# Altium project H7-Core.PrjPcb
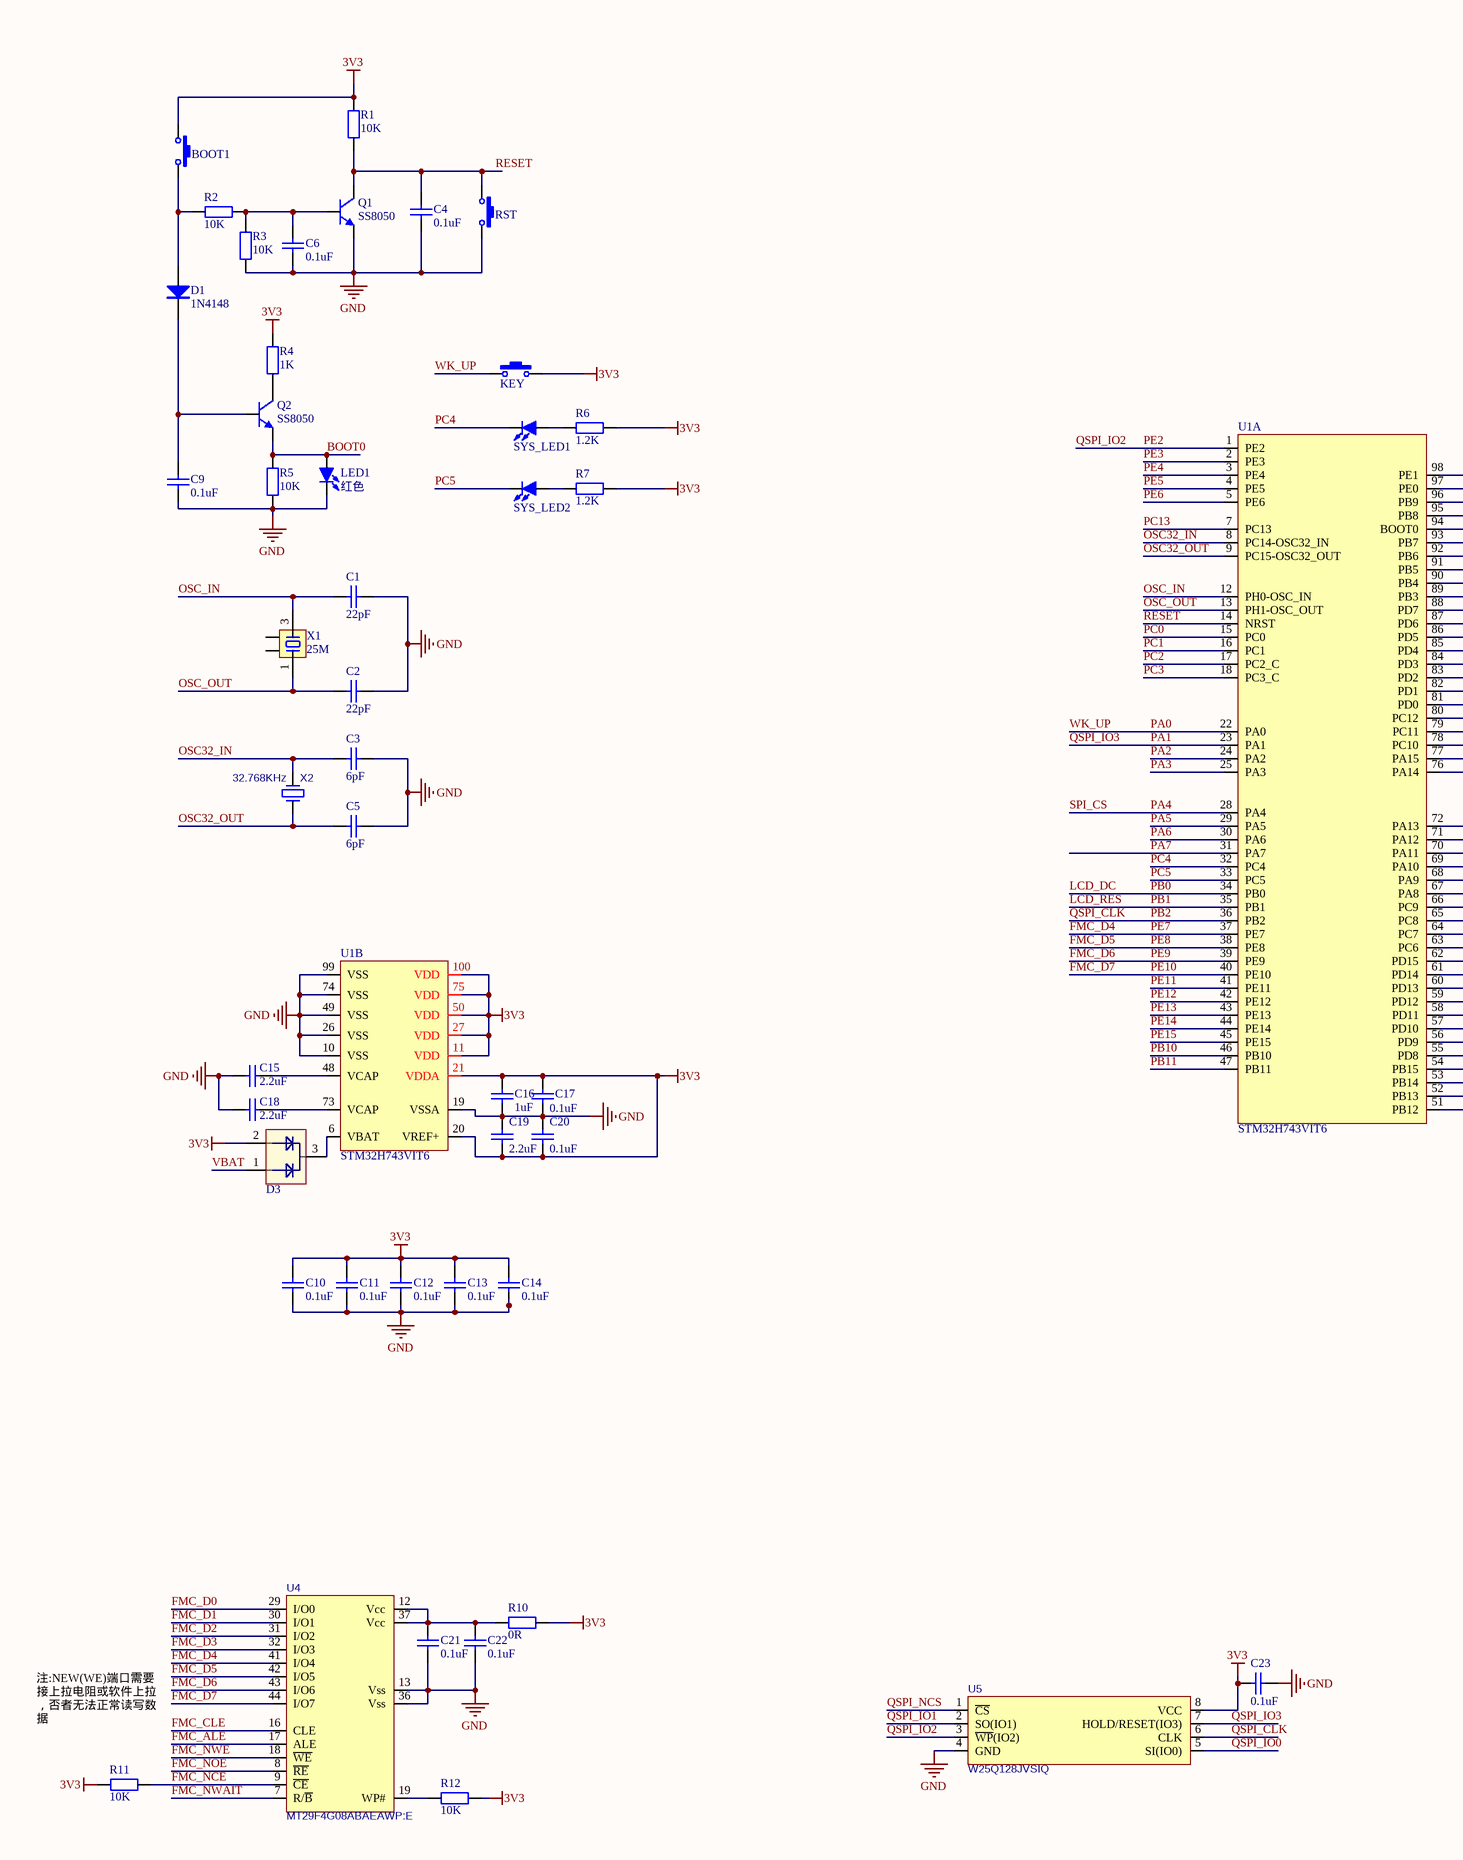
[diagram p0: H7-Core.SchDoc, left]
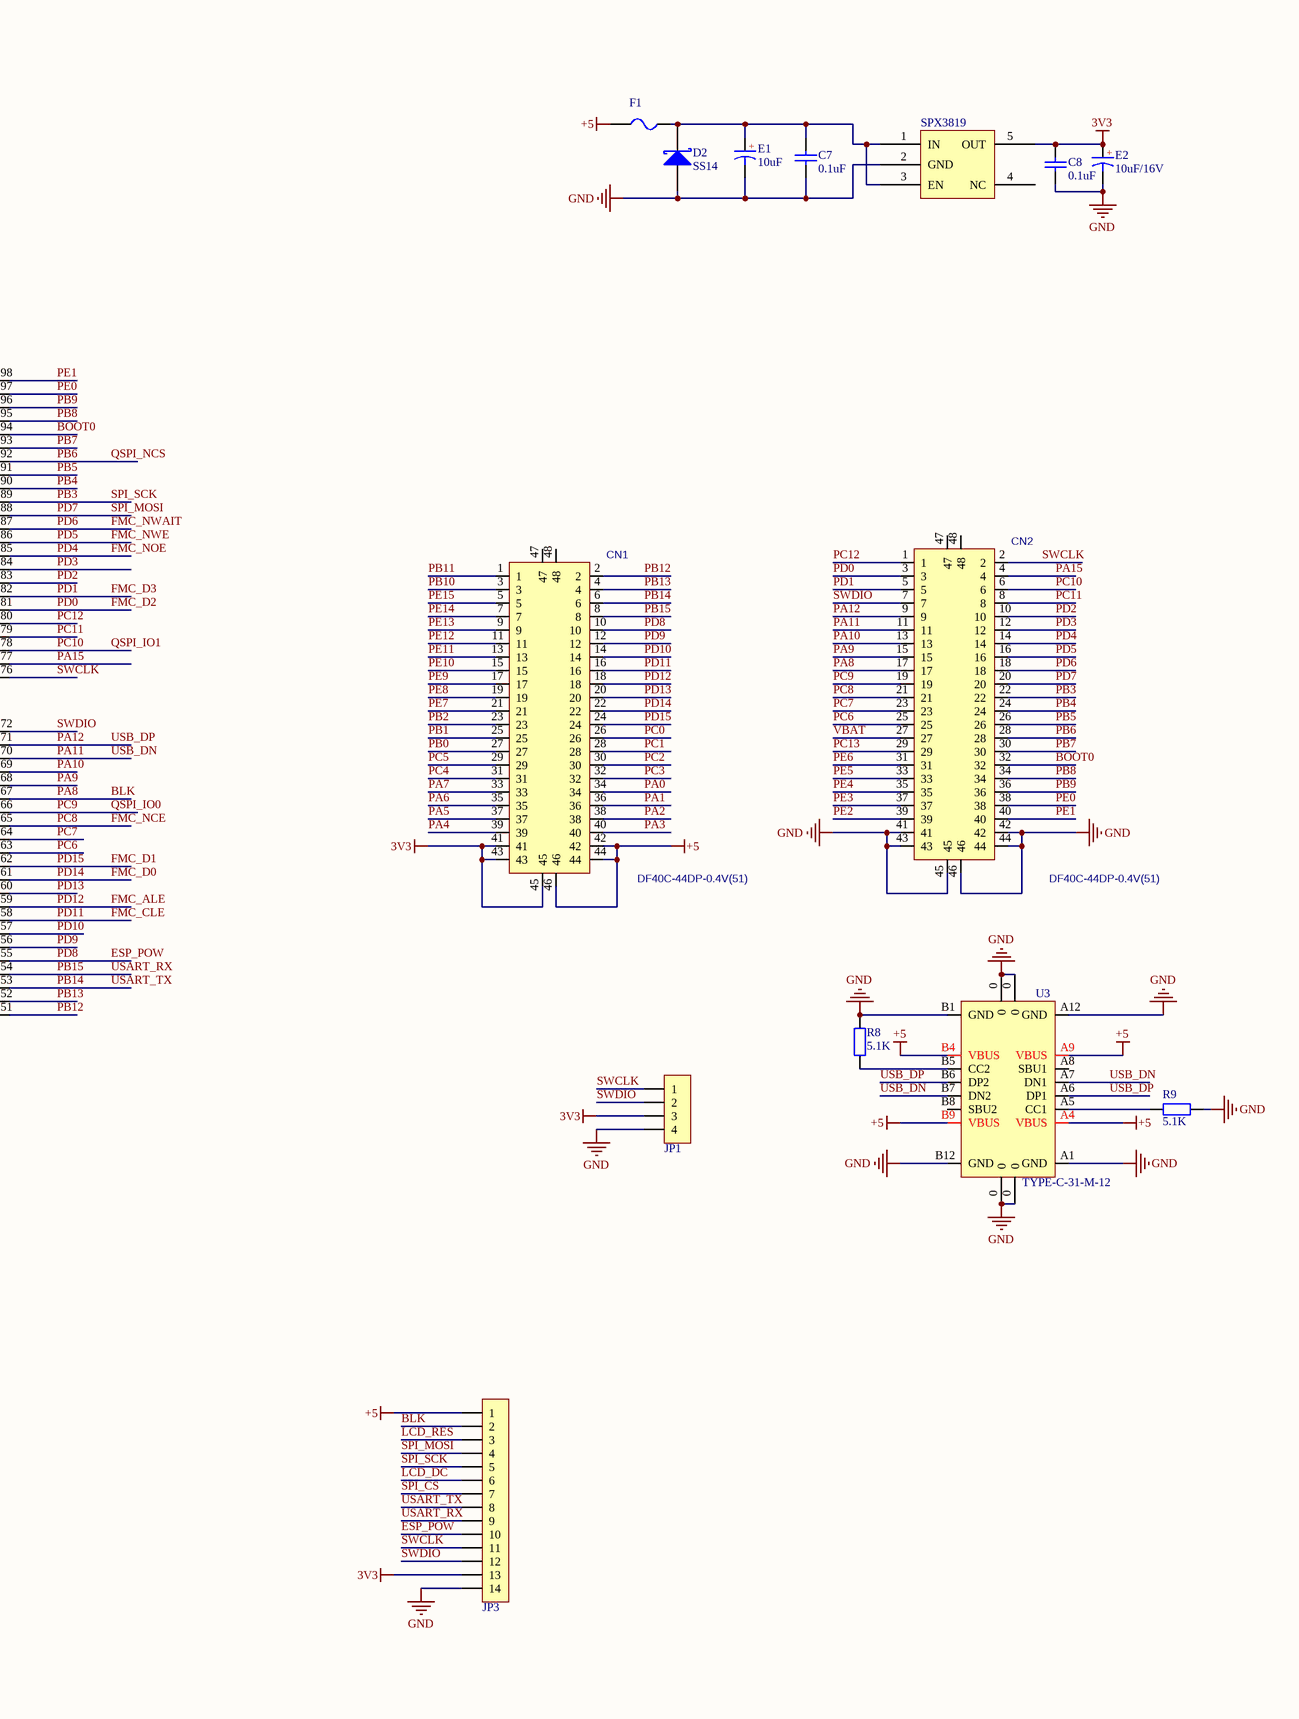
[diagram p1: H7-Core.SchDoc, right]
1 sheet, 60 parts. Net scope: global (net labels, ports and power ports of the same name join across sheets).
Board file: H7-Core.PcbDoc

## Sheet H7-Core.SchDoc
size A2; SheetNumber: 1; SheetTotal: 1

### Parts
BOOT1  3x6x5  [SW 3*6*4.3-S-W]  (value not drawn)
C1  22pF  [C0603_L]
C2  22pF  [C0603_L]
C3  6pF  [C0603_L]
C4  0.1uF  [C0603_L]
C5  6pF  [C0603_L]
C6  0.1uF  [C0603_L]
C7  0.1uF  [C0603_L]
C8  0.1uF  [C0603_L]
C9  0.1uF  [C0603_L]
C10  0.1uF  [C0603_L]
C11  0.1uF  [C0603_L]
C12  0.1uF  [C0603_L]
C13  0.1uF  [C0603_L]
C14  0.1uF  [C0603_L]
C15  2.2uF  [C0603_L]
C16  1uF  [C0603_L]
C17  0.1uF  [C0603_L]
C18  2.2uF  [C0603_L]
C19  2.2uF  [C0603_L]
C20  0.1uF  [C0603_L]
C21  0.1uF  [C0603_L]
C22  0.1uF  [C0603_L]
C23  0.1uF  [C0603_L]
CN1  DF40C-44DP-0.4V(51)  [DF40C-44DP-0.4V]
CN2  DF40C-44DP-0.4V(51)  [DF40C-44DP-0.4V]
D1  1N4148  [SOD-323]
D2  SS14  [SMA]
D3  BAT54C  [SOT23-3L]  (value not drawn)
E1  10uF  [C_3216]
E2  10uF/16V  [C_3216]
F1  MSMD200-8V 1A  [FU 0603]  (value not drawn)
JP1  HDR-1X4  [HDR2.54-LI-4P]  (value not drawn)
JP3  FH34SRJ-14S-0.5SH(50)  [FH34SRJ-14S-0.5SH(50)]  (value not drawn)
KEY  3x6x5  [SW 3*6*4.3-S-W]  (value not drawn)
LED1  红色  [LED0603_B]
Q1  SS8050  [SOT23-3N]
Q2  SS8050  [SOT23-3N]
R1  10K  [R0603_L]
R2  10K  [R0603_L]
R3  10K  [R0603_L]
R4  1K  [R0603_L]
R5  10K  [R0603_L]
R6  1.2K  [R0603_L]
R7  1.2K  [R0603_L]
R8  5.1K  [R0603_L]
R9  5.1K  [R0603_L]
R10  0R  [R0603_L]
R11  10K  [R0603_L]
R12  10K  [R0603_L]
RST  3x6x5  [SW 3*6*4.3-S-W]  (value not drawn)
SYS_LED1  红色  [LED0603_G]  (value not drawn)
SYS_LED2  绿色  [LED0603_G]  (value not drawn)
U1  STM32H743VIT6  [LQFP-100]  (parts A,B of 2)
U2  SPX3819  [SOT23-5L]
U3  TYPE-C-31-M-12  [TYPE-C-31-M-12]
U4  MT29F4G08ABAEAWP:E  [TSOP-48]
U5  W25Q128JVSIQ  [SOIC-8W]
X1  25M  [OSC 3225-4P]
X2  32.768KHz  [SMD3215-2P]

### Nets
3V3: BOOT1.1 C8.2 C10.2 C11.2 C12.2 C13.2 C14.2 C16.2 C17.2 C19.1 C20.1 C23.1 CN1.41 CN1.43 CN1.45 D3.2 E2.1(A) JP1.3 JP3.13 KEY.2 R1.1 R4.2 R6.2 R7.2 R10.2 R11.1 R12.2 U1.11(VDD) U1.20(VREF+) U1.21(VDDA) U1.27(VDD) U1.50(VDD) U1.75(VDD) U1.100(VDD) U2.5(OUT) U5.8(VCC)
+5: CN1.42 CN1.44 CN1.46 F1.1 JP3.1 U3.A4(VBUS) U3.A9(VBUS) U3.B4(VBUS) U3.B9(VBUS)
GND: C1.1 C2.1 C3.1 C4.2 C5.1 C6.2 C7.1 C8.1 C9.2 C10.1 C11.1 C12.1 C13.1 C14.1 C15.1 C16.1 C17.1 C18.1 C19.2 C20.2 C21.1 C22.1 C23.2 CN2.41 CN2.42 CN2.43 CN2.44 CN2.45 CN2.46 D2.1(A) E1.2(K) E2.2(K) JP1.4 JP3.14 LED1.2(K) Q1.2(E) R3.1 R5.2 R8.2 R9.1 RST.2 U1.10(VSS) U1.19(VSSA) U1.26(VSS) U1.49(VSS) U1.74(VSS) U1.99(VSS) U2.2(GND) U3.0 U3.A1(GND) U3.A12(GND) U3.B1(GND) U3.B12(GND) U4.13(Vss) U4.36(Vss) U5.4(GND)
BLK: CN2.17 JP3.2 U1.67(PA8)  [also labelled PA8]
BOOT0: CN2.32 LED1.1(A) Q2.2(E) R5.1 U1.94(BOOT0)
ESP_POW: CN1.10 JP3.10 U1.55(PD8)  [also labelled PD8]
FMC_ALE: CN1.18 U1.59(PD12) U4.17(ALE)  [also labelled PD12]
FMC_CLE: CN1.16 U1.58(PD11) U4.16(CLE)  [also labelled PD11]
FMC_D0: CN1.22 U1.61(PD14) U4.29(I/O0)  [also labelled PD14]
FMC_D1: CN1.24 U1.62(PD15) U4.30(I/O1)  [also labelled PD15]
FMC_D2: CN2.3 U1.81(PD0) U4.31(I/O2)  [also labelled PD0]
FMC_D3: CN2.5 U1.82(PD1) U4.32(I/O3)  [also labelled PD1]
FMC_D4: CN1.21 U1.37(PE7) U4.41(I/O4)  [also labelled PE7]
FMC_D5: CN1.19 U1.38(PE8) U4.42(I/O5)  [also labelled PE8]
FMC_D6: CN1.17 U1.39(PE9) U4.43(I/O6)  [also labelled PE9]
FMC_D7: CN1.15 U1.40(PE10) U4.44(I/O7)  [also labelled PE10]
FMC_NCE: CN2.21 R11.2 U1.65(PC8) U4.9(~{CE})  [also labelled PC8]
FMC_NOE: CN2.14 U1.85(PD4) U4.8(~{RE})  [also labelled PD4]
FMC_NWAIT: CN2.18 U1.87(PD6) U4.7(R/~{B})  [also labelled PD6]
FMC_NWE: CN2.16 U1.86(PD5) U4.18(~{WE})  [also labelled PD5]
LCD_DC: CN1.27 JP3.6 U1.34(PB0)  [also labelled PB0]
LCD_RES: CN1.25 JP3.3 U1.35(PB1)  [also labelled PB1]
OSC32_IN: C3.2 U1.8(PC14-OSC32_IN) X2.2
OSC32_OUT: C5.2 U1.9(PC15-OSC32_OUT) X2.1
OSC_IN: C1.2 U1.12(PH0-OSC_IN) X1.3
OSC_OUT: C2.2 U1.13(PH1-OSC_OUT) X1.1
PA0: CN1.34 KEY.1 U1.22(PA0)  [also labelled WK_UP]
PA1: CN1.36 U1.23(PA1) U5.7(HOLD/RESET(IO3))  [also labelled QSPI_IO3]
PA2: CN1.38 U1.24(PA2)
PA3: CN1.40 U1.25(PA3)
PA4: CN1.39 JP3.7 U1.28(PA4)  [also labelled SPI_CS]
PA5: CN1.37 U1.29(PA5)
PA6: CN1.35 U1.30(PA6)
PA7: CN1.33 U1.31(PA7)
PA9: CN2.15 U1.68(PA9)
PA10: CN2.13 U1.69(PA10)
PA11: CN2.11 U1.70(PA11) U3.A7(DN1) U3.B7(DN2)  [also labelled USB_DN]
PA12: CN2.9 U1.71(PA12) U3.A6(DP1) U3.B6(DP2)  [also labelled USB_DP]
PA15: CN2.4 U1.77(PA15)
PB2: CN1.23 U1.36(PB2) U5.6(CLK)  [also labelled QSPI_CLK]
PB3: CN2.22 JP3.5 U1.89(PB3)  [also labelled SPI_SCK]
PB4: CN2.24 U1.90(PB4)
PB5: CN2.26 U1.91(PB5)
PB6: CN2.28 U1.92(PB6) U5.1(~{CS})  [also labelled QSPI_NCS]
PB7: CN2.30 U1.93(PB7)
PB8: CN2.34 U1.95(PB8)
PB9: CN2.36 U1.96(PB9)
PB10: CN1.3 U1.46(PB10)
PB11: CN1.1 U1.47(PB11)
PB12: CN1.2 U1.51(PB12)
PB13: CN1.4 U1.52(PB13)
PB14: CN1.6 JP3.8 U1.53(PB14)  [also labelled USART_TX]
PB15: CN1.8 JP3.9 U1.54(PB15)  [also labelled USART_RX]
PC0: CN1.26 U1.15(PC0)
PC1: CN1.28 U1.16(PC1)
PC2: CN1.30 U1.17(PC2_C)
PC3: CN1.32 U1.18(PC3_C)
PC4: CN1.31 SYS_LED1.2(K) U1.32(PC4)
PC5: CN1.29 SYS_LED2.2(K) U1.33(PC5)
PC6: CN2.25 U1.63(PC6)
PC7: CN2.23 U1.64(PC7)
PC9: CN2.19 U1.66(PC9) U5.5(SI(IO0))  [also labelled QSPI_IO0]
PC10: CN2.6 U1.78(PC10) U5.2(SO(IO1))  [also labelled QSPI_IO1]
PC11: CN2.8 U1.79(PC11)
PC12: CN2.1 U1.80(PC12)
PC13: CN2.29 U1.7(PC13)
PD2: CN2.10 U1.83(PD2)
PD3: CN2.12 U1.84(PD3)
PD7: CN2.20 JP3.4 U1.88(PD7)  [also labelled SPI_MOSI]
PD9: CN1.12 U1.56(PD9)
PD10: CN1.14 U1.57(PD10)
PD13: CN1.20 U1.60(PD13)
PE0: CN2.38 U1.97(PE0)
PE1: CN2.40 U1.98(PE1)
PE2: CN2.39 U1.1(PE2) U5.3(~{WP}(IO2))  [also labelled QSPI_IO2]
PE3: CN2.37 U1.2(PE3)
PE4: CN2.35 U1.3(PE4)
PE5: CN2.33 U1.4(PE5)
PE6: CN2.31 U1.5(PE6)
PE11: CN1.13 U1.41(PE11)
PE12: CN1.11 U1.42(PE12)
PE13: CN1.9 U1.43(PE13)
PE14: CN1.7 U1.44(PE14)
PE15: CN1.5 U1.45(PE15)
RESET: C4.1 Q1.3(C) R1.2 RST.1 U1.14(NRST)
SWCLK: CN2.2 JP1.1 JP3.11 U1.76(PA14)
SWDIO: CN2.7 JP1.2 JP3.12 U1.72(PA13)
VBAT: CN2.27 D3.1
NetBOOT1_2: BOOT1.2 D1.1(A) R2.1
NetC6_1: C6.1 Q1.1(B) R2.2 R3.2
NetC7_2: C7.2 D2.2(K) E1.1(A) F1.2 U2.1(IN) U2.3(EN)
NetC9_1: C9.1 D1.2(K) Q2.1(B)
NetC15_2: C15.2 U1.48(VCAP)
NetC18_2: C18.2 U1.73(VCAP)
NetC21_2: C21.2 C22.2 R10.1 U4.12(Vcc) U4.37(Vcc)
NetD3_3: D3.3 U1.6(VBAT)
NetQ2_3: Q2.3(C) R4.1
NetR6_1: R6.1 SYS_LED1.1(A)
NetR7_1: R7.1 SYS_LED2.1(A)
NetR8_1: R8.1 U3.B5(CC2)
NetR9_2: R9.2 U3.A5(CC1)
NetR12_1: R12.1 U4.19(WP#)

Not connected (* = marked no-connect by the designer): CN1 47 48; CN2 47 48; U2 4(NC); U3 A8(SBU1) B8(SBU2); U4 1(NC) 2(NC) 3(NC) 4(NC) 5(NC) 6(NC) 10(NC) 11(NC) 14(NC) 15(NC) 20(DNU) 21(DNU) 22(DNU) 23(NC) 24(NC) 25(NC) 26(NC) 27(NC) 28(NC) 33(NC) 34(NC) 35(NC) 38(PRE/VSS) 39(NC) 40(NC) 45(NC) 46(NC) 47(NC) 48(NC); X1 2 4

### Notes on the sheet
- (near R11) 注:NEW(WE)端口需要接上拉电阻或软件上拉，否者无法正常读写数据
- (in symbol CT) +

### Library data of the parts
BOOT1 KEY RST = SW-PB: 微动开关; BOM名称: 3x6轻触开关; 联系卖家，免费查找封装: 唯一出售店铺网址https://shop463601444.taobao.com
C1-C23 = C: 贴片电容; BOM名称: 无极性贴片电容; 联系卖家，免费查找封装: 唯一出售店铺网址https://shop463601444.taobao.com; 封装库来自淘宝卖家ID：黄晶宝石: 其他店铺购入均为盗版假冒封装库，请立即申请退款
CN1 CN2 = DF40C-44DP-0.4V(51): 公座 /; BOM_Manufacturer: HRS(广濑); BOM_Manufacturer Part: DF40C-40DP-0.4V(51); Contributor: LCSC; BOM_Supplier: LCSC; BOM_Supplier Part: C424643; BOM_JLCPCB Part Class: Extended Part; spicePre: C; spiceSymbolName: DF40C-40DP-0.4V(51)
D1 = 1N4148: 开关二极管; BOM名称: 高速开关二极管; 联系卖家，免费查找封装: 唯一出售店铺网址https://shop463601444.taobao.com
D2 = SS14: 肖特基二极管; 属性: 40V/1A; 联系卖家，免费查找封装: 唯一出售店铺网址https://shop463601444.taobao.com; BOM名称: 肖特基二极管
D3 = BAT54C: 两路肖特基二极管
E1 E2 = CT: C7171; BOM名称: 贴片钽电容; 联系卖家，免费查找封装: 唯一出售店铺网址https://shop463601444.taobao.com; 封装库来自淘宝卖家ID：黄晶宝石: 其他店铺购入均为盗版假冒封装库，请立即申请退款
F1 = FU: 贴片保险丝; 联系卖家，免费查找封装: 唯一出售店铺网址https://shop463601444.taobao.com; BOM名称: 贴片保险丝
JP1 = Header 4: 4P接插件; 封装库来自淘宝卖家 ID：黄晶宝石: 其他店铺购入均为盗版假冒封装库; 联系卖家，免费查找封装: 唯一出售店铺网址https://shop463601444.taobao.com; BOM名称: 4P接插件
JP3 = FH34SRJ-14S-0.5SH(50): C324724
LED1 = LED-SMD: 贴片LED; 封装库来自淘宝卖家 ID：黄晶宝石: 其他店铺购入均为假冒，请立即申请退款，本店奖励现金5~20元; BOM名称: 贴片LED
Q1 Q2 = 8050-SMD: 高频放大-NPN型; 联系卖家，免费查找封装: 唯一出售店铺网址https://shop463601444.taobao.com; 封装库来自淘宝卖家 ID：黄晶宝石: 其他店铺购入均为盗版，不享受售后技术支持服务，请立即申请退款; 参数: 40V 1.5A 1W 100MHZ; BOM名称: 高频放大-NPN型
R1-R12 = R: 贴片电阻; 联系卖家，免费查找封装: 唯一出售店铺网址https://shop463601444.taobao.com; 封装库来自淘宝卖家ID：黄晶宝石: 其他店铺购入均为盗版假冒封装库，请立即申请退款; BOM名称: 贴片电阻
SYS_LED1 = LED-SMD: C2286; BOM名称: 贴片LED; 封装库来自淘宝卖家 ID：黄晶宝石: 其他店铺购入均为假冒，请立即申请退款，本店奖励现金5~20元
SYS_LED2 = LED-SMD: C72043; BOM名称: 贴片LED; 封装库来自淘宝卖家 ID：黄晶宝石: 其他店铺购入均为假冒，请立即申请退款，本店奖励现金5~20元
U4 = MT29F4G08ABAEAWP:E: C496612; BOM_Manufacturer: micron(镁光); Contributor: LCSC; BOM_Supplier: LCSC; BOM_Supplier Part: C496612; BOM_Manufacturer Part: MT29F4G08ABAEAWP:E; BOM_JLCPCB Part Class: Extended Part; spicePre: U; spiceSymbolName: MT29F4G08ABAEAWP:E
U5 = W25Q128: SPI FLASH; 封装库来自 淘宝卖家 ID：黄晶宝石: 其他店铺购入均为盗版假冒封装库，请立即申请退款
X1 = XTAL-4P: 4脚无源晶振; 联系卖家，免费查找封装: 唯一出售店铺网址https://shop463601444.taobao.com; BOM名称: 4脚无源晶振
X2 = 32.768KHz: 立创商城:C48615; BOM_Manufacturer Part: Q13FC1350000200; BOM_Manufacturer: EPSON; nameAlias: Frequency; BOM_Supplier: LCSC; BOM_Supplier Part: C48615; BOM_JLCPCB Part Class: Extended Part; spicePre: X; spiceSymbolName: Q13FC1350000200